# EAGLE design funcgen (EAGLE 9.6.2)

## Sheet 1 of 3
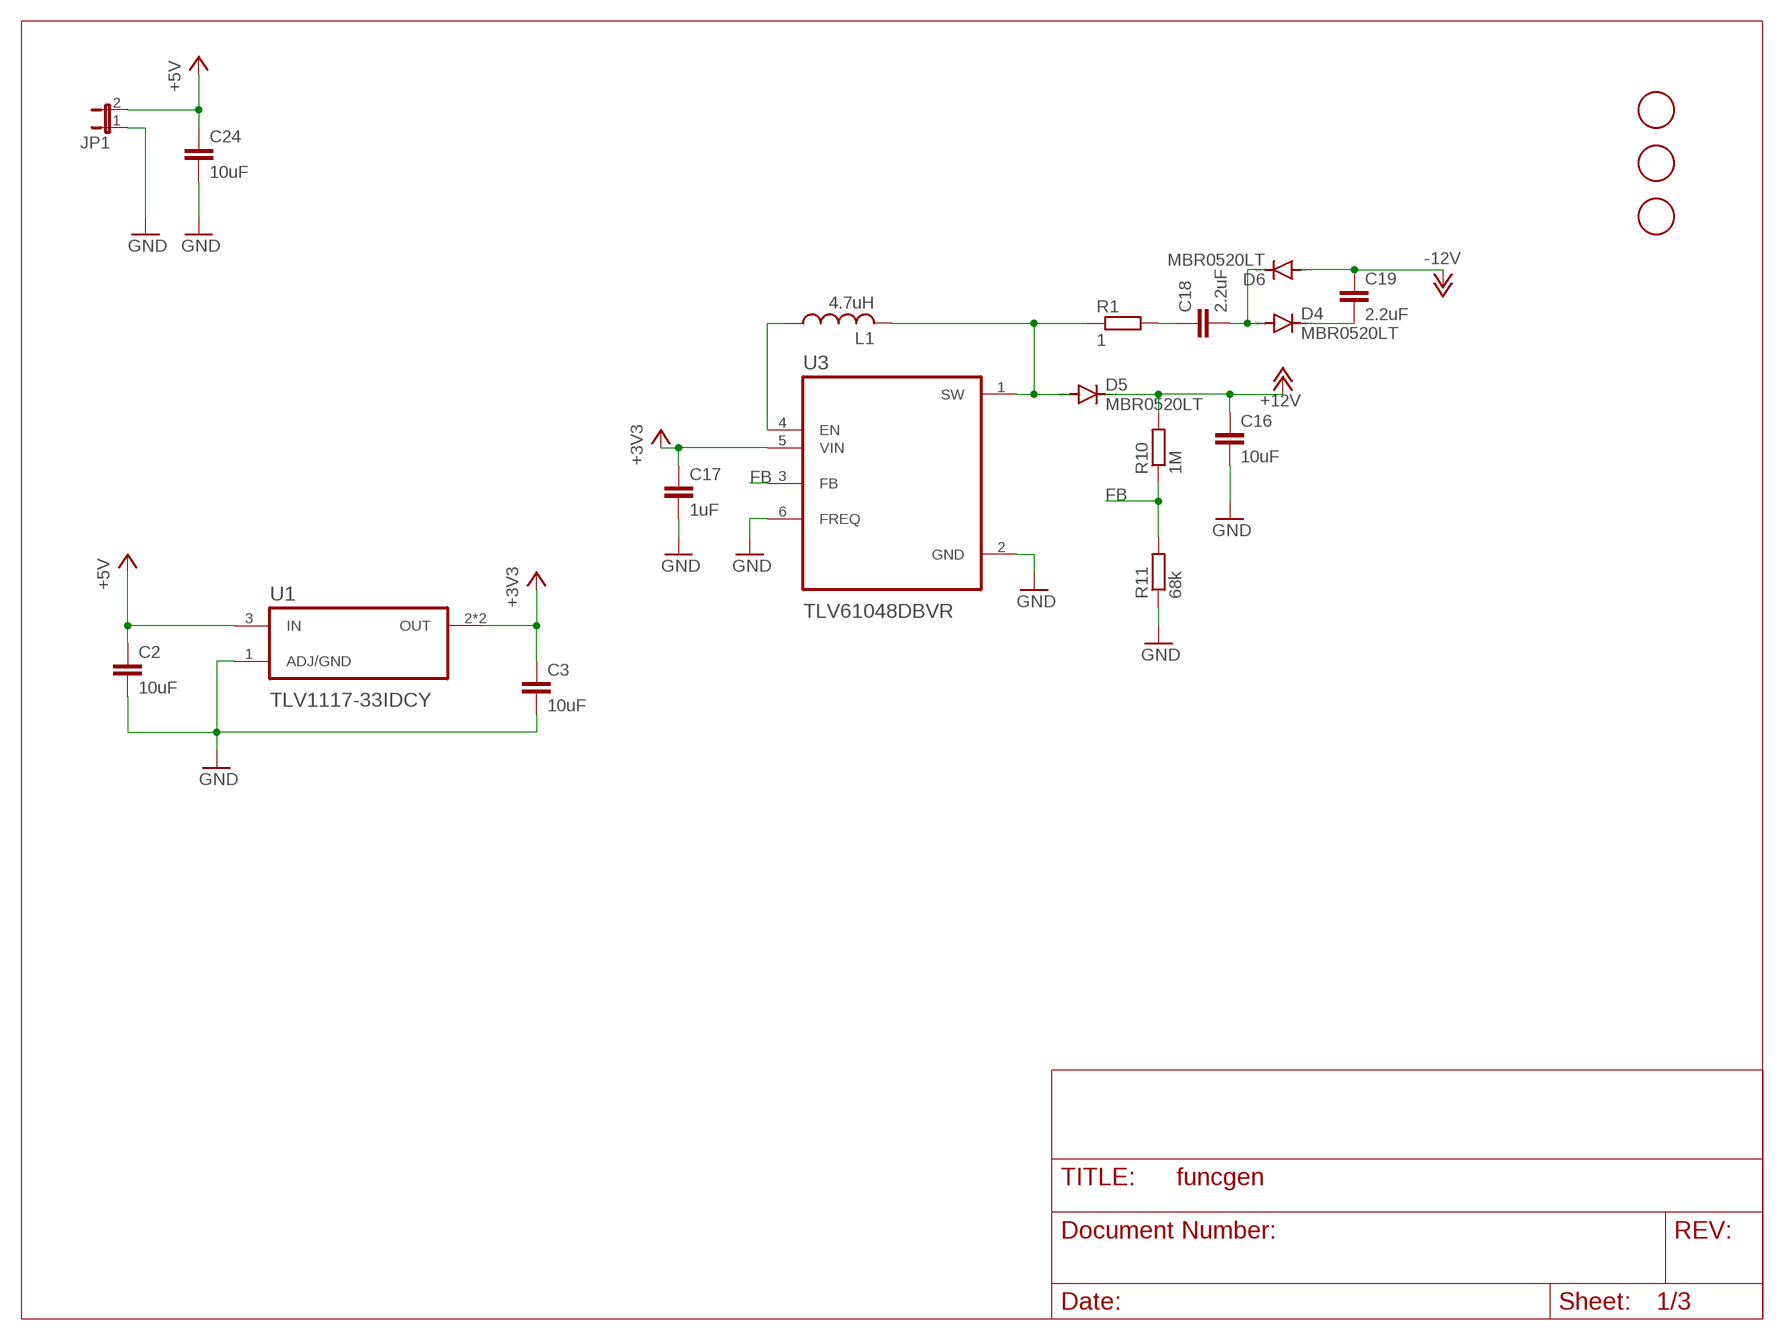
[diagram p0: schematic, sheet 1]

### Parts
C2  10uF  C-EUC0805  [C0805]
C3  10uF  C-EUC0805  [C0805]
C16  10uF  C-EUC0805  [C0805]
C17  1uF  C-EUC0805  [C0805]
C18  2.2uF  C-EUC0805  [C0805]
C19  2.2uF  C-EUC0805  [C0805]
C24  10uF  C-EUC0805  [C0805]
D4  MBR0520LT  [SOD123]
D5  MBR0520LT  [SOD123]
D6  MBR0520LT  [SOD123]
JP1  JP1E  [JP1]
L1  4.7uH  L-USL0805  [C0805]
R1  1  R-EU_R0805  [R0805]
R10  1M  R-EU_R0805  [R0805]
R11  68k  R-EU_R0805  [R0805]
U1  TLV1117-33IDCY  [SOT230P700X180-4N]
U3  TLV61048DBVR  [SOT95P280X145-6N]
U$1  FIDUCIAL  [FIDUCIAL_1MM]
U$3  FIDUCIAL  [FIDUCIAL_1MM]
U$4  FIDUCIAL  [FIDUCIAL_1MM]

### Nets
+3V3: C3.1 C17.1 U1.2(OUT) U1.4(OUT) U3.5(VIN) ; also sheet 2
+5V: C2.1 C24.1 JP1.2 U1.3(IN) ; also sheet 2,3
+12V: C16.1 D5.C R10.2 ; also sheet 2
-12V: C19.1 D6.A ; also sheet 2
FB: R10.1 R11.2 U3.3(FB)
GND: C2.2 C3.2 C16.2 C17.2 C24.2 JP1.1 R11.1 U1.1(ADJ/GND) U3.2(GND) U3.6(FREQ) ; also sheet 2,3
N$8: L1.1 U3.4(EN)
N$9: D5.A L1.2 R1.1 U3.1(SW)
N$10: C18.1 R1.2
N$11: C18.2 D4.A D6.C
N$12: C19.2 D4.C

## Sheet 2 of 3
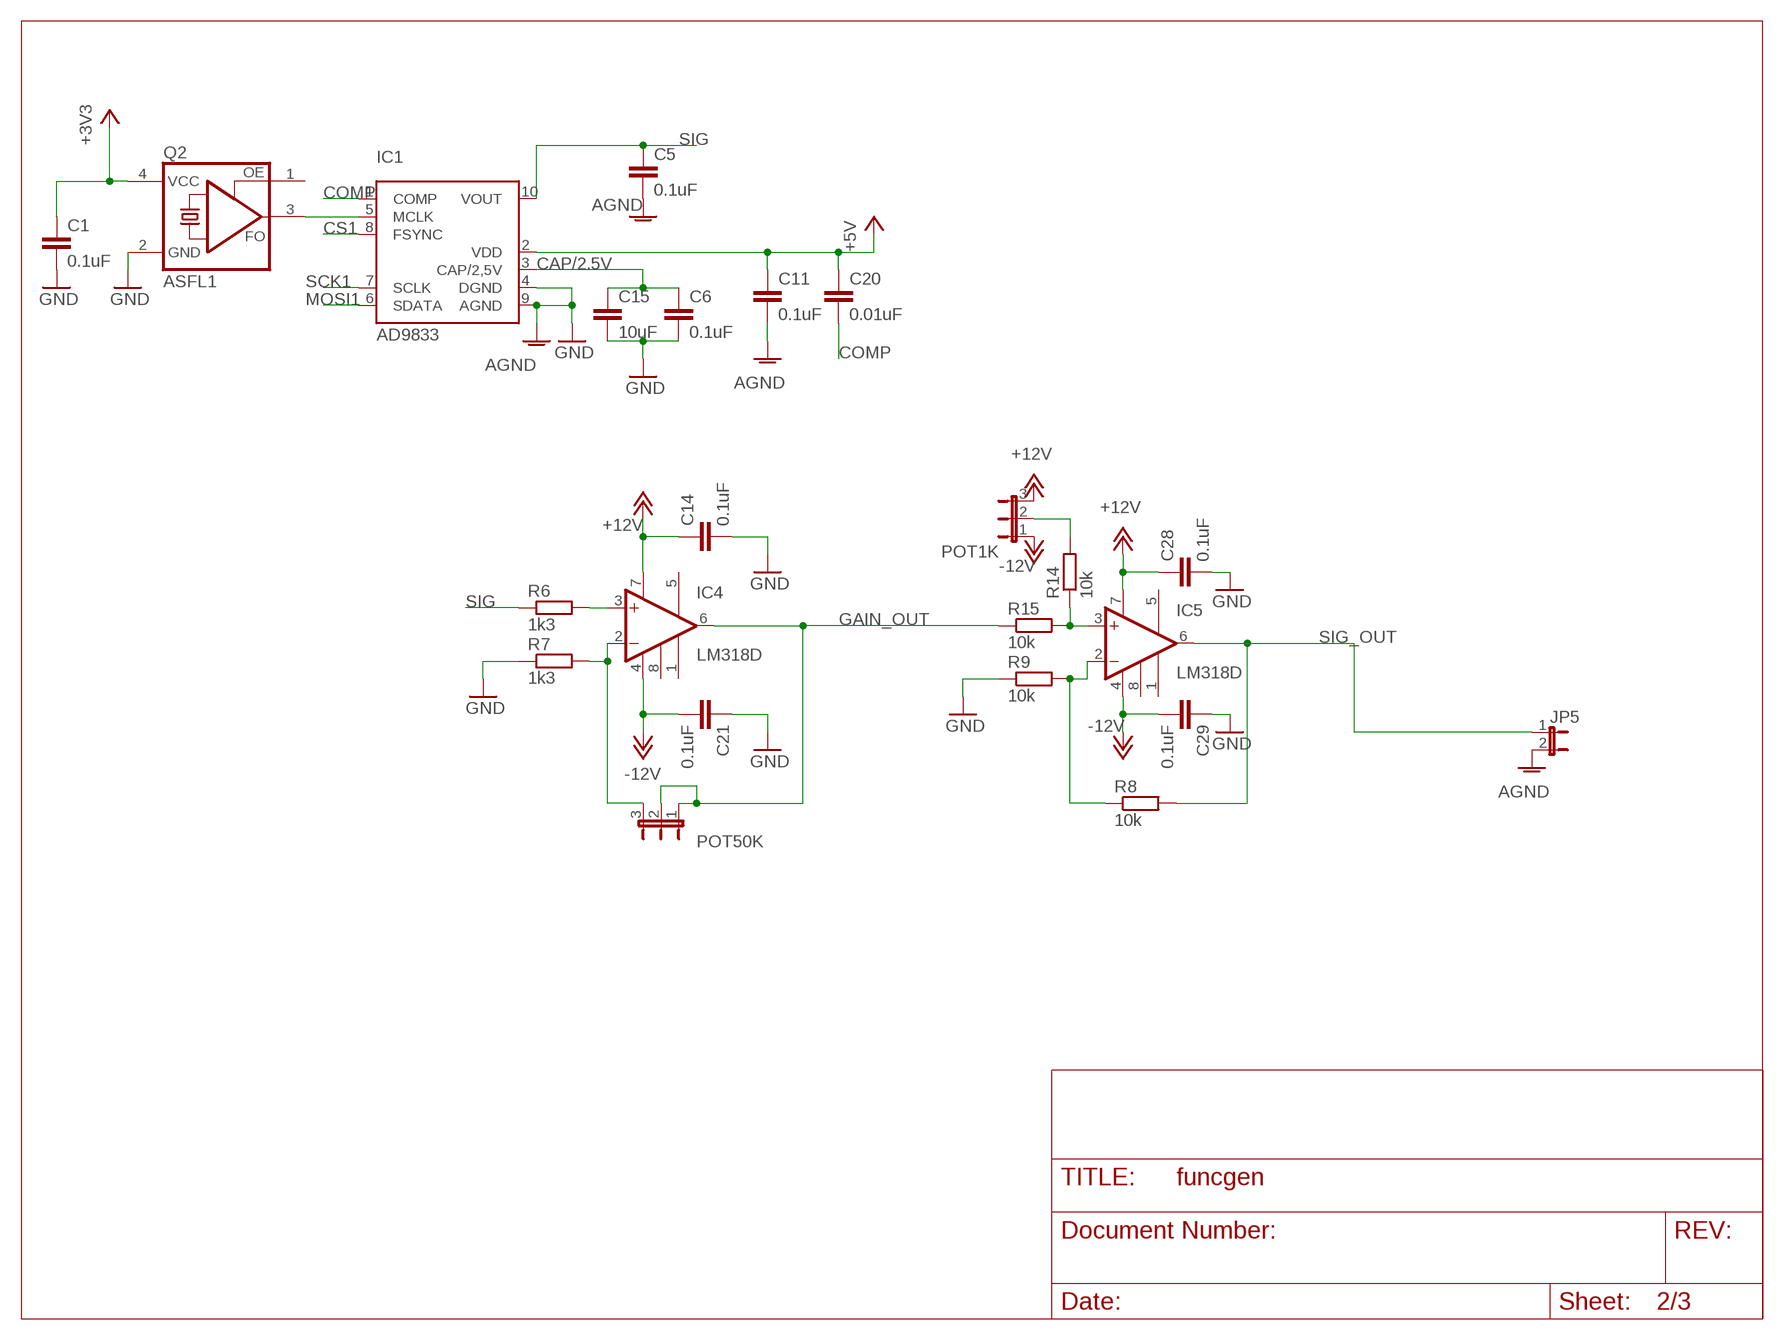
[diagram p1: schematic, sheet 2]

### Parts
C1  0.1uF  C-EUC0805  [C0805]
C5  0.1uF  C-EUC0805  [C0805]
C6  0.1uF  C-EUC0805  [C0805]
C11  0.1uF  C-EUC0805  [C0805]
C14  0.1uF  C-EUC0805  [C0805]
C15  10uF  C-EUC0805  [C0805]
C20  0.01uF  C-EUC0805  [C0805]
C21  0.1uF  C-EUC0805  [C0805]
C28  0.1uF  C-EUC0805  [C0805]
C29  0.1uF  C-EUC0805  [C0805]
IC1  AD9833  [MSOP10]
IC4  LM318D  [SOIC8]
IC5  LM318D  [SOIC8]
JP5  JP1E  [JP1]
POT1K  JP2E  [JP2]
POT50K  JP2E  [JP2]
Q2  ASFL1  [ASF]
R6  1k3  R-EU_R0805  [R0805]
R7  1k3  R-EU_R0805  [R0805]
R8  10k  R-EU_R0805  [R0805]
R9  10k  R-EU_R0805  [R0805]
R14  10k  R-EU_R0805  [R0805]
R15  10k  R-EU_R0805  [R0805]

### Nets
+3V3: C1.1 Q2.4(VCC) ; also sheet 1
+5V: C11.1 C20.1 IC1.2(VDD) ; also sheet 1,3
+12V: C14.1 C28.1 IC4.7(V+) IC5.7(V+) POT1K.3 ; also sheet 1
-12V: C21.2 C29.2 IC4.4(V-) IC5.4(V-) POT1K.1 ; also sheet 1
AGND: C5.2 C11.2 IC1.4(DGND) IC1.9(AGND) JP5.2 ; supply symbol labelled GND
CAP/2.5V: C6.1 C15.1 IC1.3(CAP/2,5V)
COMP: C20.2 IC1.1(COMP)
CS1: IC1.8(FSYNC) ; also sheet 3
GAIN_OUT: IC4.6(OUT) POT50K.1 POT50K.2 R15.1
GND: C1.2 C6.2 C14.2 C15.2 C21.1 C28.2 C29.1 Q2.2(GND) R7.1 R9.1 ; also sheet 1,3
MOSI1: IC1.6(SDATA) ; also sheet 3
N$6: IC1.5(MCLK) Q2.3(FO)
N$21: IC4.3(+IN) R6.2
N$22: IC4.2(-IN) POT50K.3 R7.2
N$24: IC5.3(+IN) R14.1 R15.2
N$25: POT1K.2 R14.2
N$26: IC5.2(-IN) R8.1 R9.2
SCK1: IC1.7(SCLK) ; also sheet 3
SIG: C5.1 IC1.10(VOUT) R6.1
SIG_OUT: IC5.6(OUT) JP5.1 R8.2
Unconnected: IC4.1(BAL1) IC4.5(BAL2) IC4.8(COMP) IC5.1(BAL1) IC5.5(BAL2) IC5.8(COMP) Q2.1(OE)

## Sheet 3 of 3
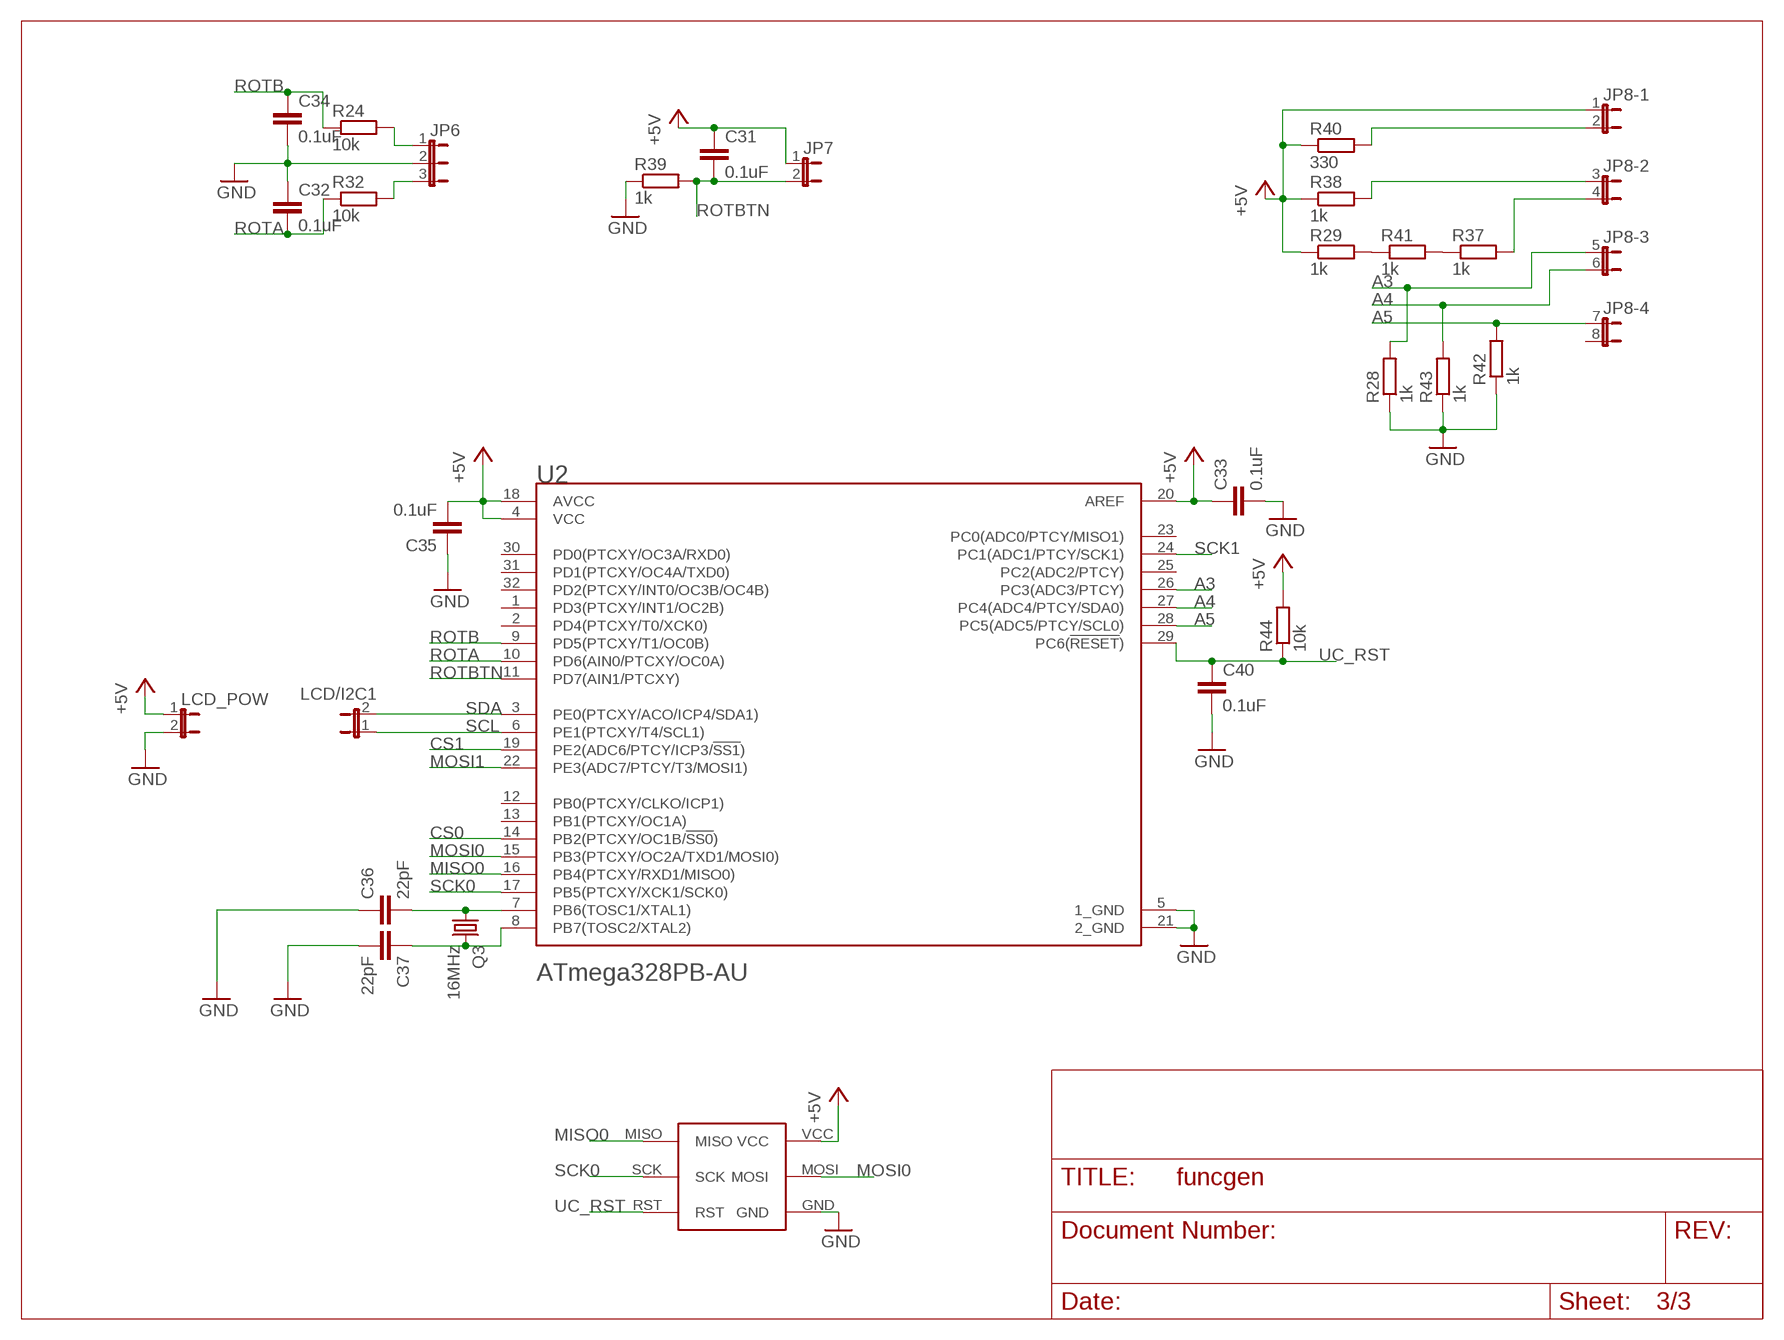
[diagram p2: schematic, sheet 3]

### Parts
C31  0.1uF  C-EUC0805  [C0805]
C32  0.1uF  C-EUC0805  [C0805]
C33  0.1uF  C-EUC0805  [C0805]
C34  0.1uF  C-EUC0805  [C0805]
C35  0.1uF  C-EUC0805  [C0805]
C36  22pF  C-EUC0805  [C0805]
C37  22pF  C-EUC0805  [C0805]
C40  0.1uF  C-EUC0805  [C0805]
JP6  JP2E  [JP2]
JP7  JP1E  [JP1]
JP8  JP4QE  [JP4Q]
LCD/I2C1  JP1E  [JP1]
LCD_POW  JP1E  [JP1]
Q3  16MHz  CRYSTALHC49UP  [HC49UP]
R24  10k  R-EU_R0805  [R0805]
R28  1k  R-EU_R0805  [R0805]
R29  1k  R-EU_R0805  [R0805]
R32  10k  R-EU_R0805  [R0805]
R37  1k  R-EU_R0805  [R0805]
R38  1k  R-EU_R0805  [R0805]
R39  1k  R-EU_R0805  [R0805]
R40  330  R-EU_R0805  [R0805]
R41  1k  R-EU_R0805  [R0805]
R42  1k  R-EU_R0805  [R0805]
R43  1k  R-EU_R0805  [R0805]
R44  10k  R-EU_R0805  [R0805]
U2  MICROCHIP_ATMEGA328PB-AUMICROCHIP_ATMEGA328PB-AU_0_0  [MICROCHIP_ATMEGA328PB-AU_0]
U$2  AVR-ISP  [AVR-ISP]

### Nets
+5V: C31.1 C33.1 C35.2 JP7.1 JP8.1 LCD_POW.1 R29.1 R38.1 R40.1 R44.2 U2.4(VCC) U2.18(AVCC) U2.20(AREF) U$2.VCC ; also sheet 1,2
A3: JP8.5 R28.2 U2.26(PC3(ADC3/PTCY))
A4: JP8.6 R43.2 U2.27(PC4(ADC4/PTCY/SDA0))
A5: JP8.7 R42.2 U2.28(PC5(ADC5/PTCY/SCL0))
CS0: U2.14(PB2(PTCXY/OC1B/!SS0!))
CS1: U2.19(PE2(ADC6/PTCY/ICP3/!SS1!)) ; also sheet 2
GND: C32.1 C33.2 C34.2 C35.1 C36.1 C37.2 C40.2 JP6.2 LCD_POW.2 R28.1 R39.1 R42.1 R43.1 U2.5(1_GND) U2.21(2_GND) U$2.GND ; also sheet 1,2
MISO0: U2.16(PB4(PTCXY/RXD1/MISO0)) U$2.MISO
MOSI0: U2.15(PB3(PTCXY/OC2A/TXD1/MOSI0)) U$2.MOSI
MOSI1: U2.22(PE3(ADC7/PTCY/T3/MOSI1)) ; also sheet 2
N$30: JP6.1 R24.2
N$31: JP6.3 R32.2
N$32: C36.2 Q3.1 U2.7(PB6(TOSC1/XTAL1))
N$33: C37.1 Q3.2 U2.8(PB7(TOSC2/XTAL2))
N$34: R37.1 R41.2
N$35: R29.2 R41.1
N$36: JP8.2 R40.2
N$37: JP8.3 R38.2
N$38: JP8.4 R37.2
ROTA: C32.2 R32.1 U2.10(PD6(AIN0/PTCXY/OC0A))
ROTB: C34.1 R24.1 U2.9(PD5(PTCXY/T1/OC0B))
ROTBTN: C31.2 JP7.2 R39.2 U2.11(PD7(AIN1/PTCXY))
SCK0: U2.17(PB5(PTCXY/XCK1/SCK0)) U$2.SCK
SCK1: U2.24(PC1(ADC1/PTCY/SCK1)) ; also sheet 2
SCL: LCD/I2C1.1 U2.6(PE1(PTCXY/T4/SCL1))
SDA: LCD/I2C1.2 U2.3(PE0(PTCXY/ACO/ICP4/SDA1))
UC_RST: C40.1 R44.1 U2.29(PC6(!RESET!)) U$2.RST
Unconnected: JP8.8 U2.1(PD3(PTCXY/INT1/OC2B)) U2.2(PD4(PTCXY/T0/XCK0)) U2.12(PB0(PTCXY/CLKO/ICP1)) U2.13(PB1(PTCXY/OC1A)) U2.23(PC0(ADC0/PTCY/MISO1)) U2.25(PC2(ADC2/PTCY)) U2.30(PD0(PTCXY/OC3A/RXD0)) U2.31(PD1(PTCXY/OC4A/TXD0)) U2.32(PD2(PTCXY/INT0/OC3B/OC4B))

## Library data of the parts
C1-C3 C5 C6 C11 C14-C21 C24 C28 C29 C31-C37 C40 = rcl:C-EU: CAPACITOR, European symbol; SPICEPREFIX: C
D4-D6 = diode:MBR0520LT: SCHOTTKY BARRIER RECTIFIER Source: http://onsemi.com .. MBR0520LT1-D.pdf
IC1 = AD9833:AD9833: LowPower Waveform Generator Clock Rate up to 12,5 MHz Serial Interface Low Pin Count Check prices <https://pricing.snapeda.com/search/part/AD9833/?ref=eda>; AVAILABILITY: Bad; DESCRIPTION: Direct Digital Synthesis IC 10 b 25MHz 28 b Tuning 10-MSOP; MF: Analog Devices; MP: AD9833; PACKAGE: MSOP-10 Analog Devices; PRICE: None
IC4 IC5 = linear:LM*18: FAST GENERAL-PURPOSE OPERATIONAL AMPLIFIER Sourde: http://focus.ti.com/lit/ds/slos063b/slos063b.pdf
JP1 JP5 JP7 LCD/I2C1 LCD_POW = jumper:JP1E: JUMPER
JP6 POT1K POT50K = jumper:JP2E: JUMPER
JP8 = jumper:JP4QE: JUMPER
L1 = rcl_2:L-US: INDUCTOR, American symbol
Q2 = crystal:ASF*: CRYSTAL CLOCK OSCILLATORS 5.0 Vdc or 3.3 Vdc - LOW PROFILE ULTRA MINIATURE CERAMIC SURFACE MOUNT Source: http://www.abracon.com/Oscillators/asf1-L-L1.pdf; MF: Abracon Corporation; MPN: ASFL1-125.000MHZ-EC-T; OC_FARNELL: 1838931; OC_NEWARK: 19M1882
Q3 = crystal:CRYSTAL: CRYSTAL; OC_FARNELL: unknown; OC_NEWARK: unknown
R1 R6-R11 R14 R15 R24 R28 R29 R32 R37-R44 = rcl:R-EU_: RESISTOR, European symbol; SPICEPREFIX: R
U1 = TLV1117-33IDCY:TLV1117-33IDCY: Check prices <https://pricing.snapeda.com/parts/TLV1117-33IDCY/Texas%20Instruments/view-part?ref=eda>; AVAILABILITY: Good; DESCRIPTION: 800-mA, 15-V, linear voltage regulator 4-SOT-223 -40 to 125; MF: Texas Instruments; MP: TLV1117-33IDCY; PACKAGE: SOT-223-4 Texas Instruments; PRICE: None; PURCHASE-URL: https://pricing.snapeda.com/search/part/TLV1117-33IDCY/?ref=eda
U2 = Microchip - ATmega328PB-AU:MICROCHIP_ATMEGA328PB-AU: ATmega328PB Summary Datasheet; CENTROID_NOT_SPECIFIED: No; DATASHEET: http://ww1.microchip.com/downloads/en/DeviceDoc/40001907A.pdf; DIGIKEY_DESCRIPTION: IC MCU 8BIT 32KB FLASH 32TQFP; DIGIKEY_PART_NUMBER: ATMEGA328PB-AU-ND; LEAD_FREE: yes; MF: Microchip; MFG_PACKAGE_IDENT: 32A; MOUSER_PART_NUMBER: 556-ATMEGA328PB-AU; MPN: ATmega328PB-AU; PACKAGE: TQFP32; PREFIX: U; ROHS: yes; TEMPERATURE_RANGE_HIGH: +85°C; TEMPERATURE_RANGE_LOW: -40°C; VOLTAGE: 5.5V
U3 = TLV61048DBVR:TLV61048DBVR: Check prices <https://pricing.snapeda.com/search/part/TLV61048DBVR/?ref=eda>; AVAILABILITY: Warning; DESCRIPTION: 14-V output voltage non-synchronous boost converter in SOT-23 package 6-SOT-23 -40 to 125; MF: Texas Instruments; MP: TLV61048DBVR; PACKAGE: SOT-23-6 Texas Instruments; PRICE: None; PURCHASE-URL: https://pricing.snapeda.com/search/part/TLV61048DBVR/?ref=eda
U$1 U$3 U$4 = ECE388:FIDUCIAL: For use by pick and place machines to calibrate the vision/machine, 1mm By microbuilder.eu
U$2 = AVR-ISP:AVR-ISP: Check prices <https://pricing.snapeda.com/parts/AVR-ISP/Gravitech/view-part?ref=eda>; AVAILABILITY: Bad; DESCRIPTION: Emulators / Simulators AVR USB IN CIRCUIT EMUL/PRGMR ISP; MF: Gravitech; MP: AVR-ISP; PACKAGE: None; PRICE: None

## Board
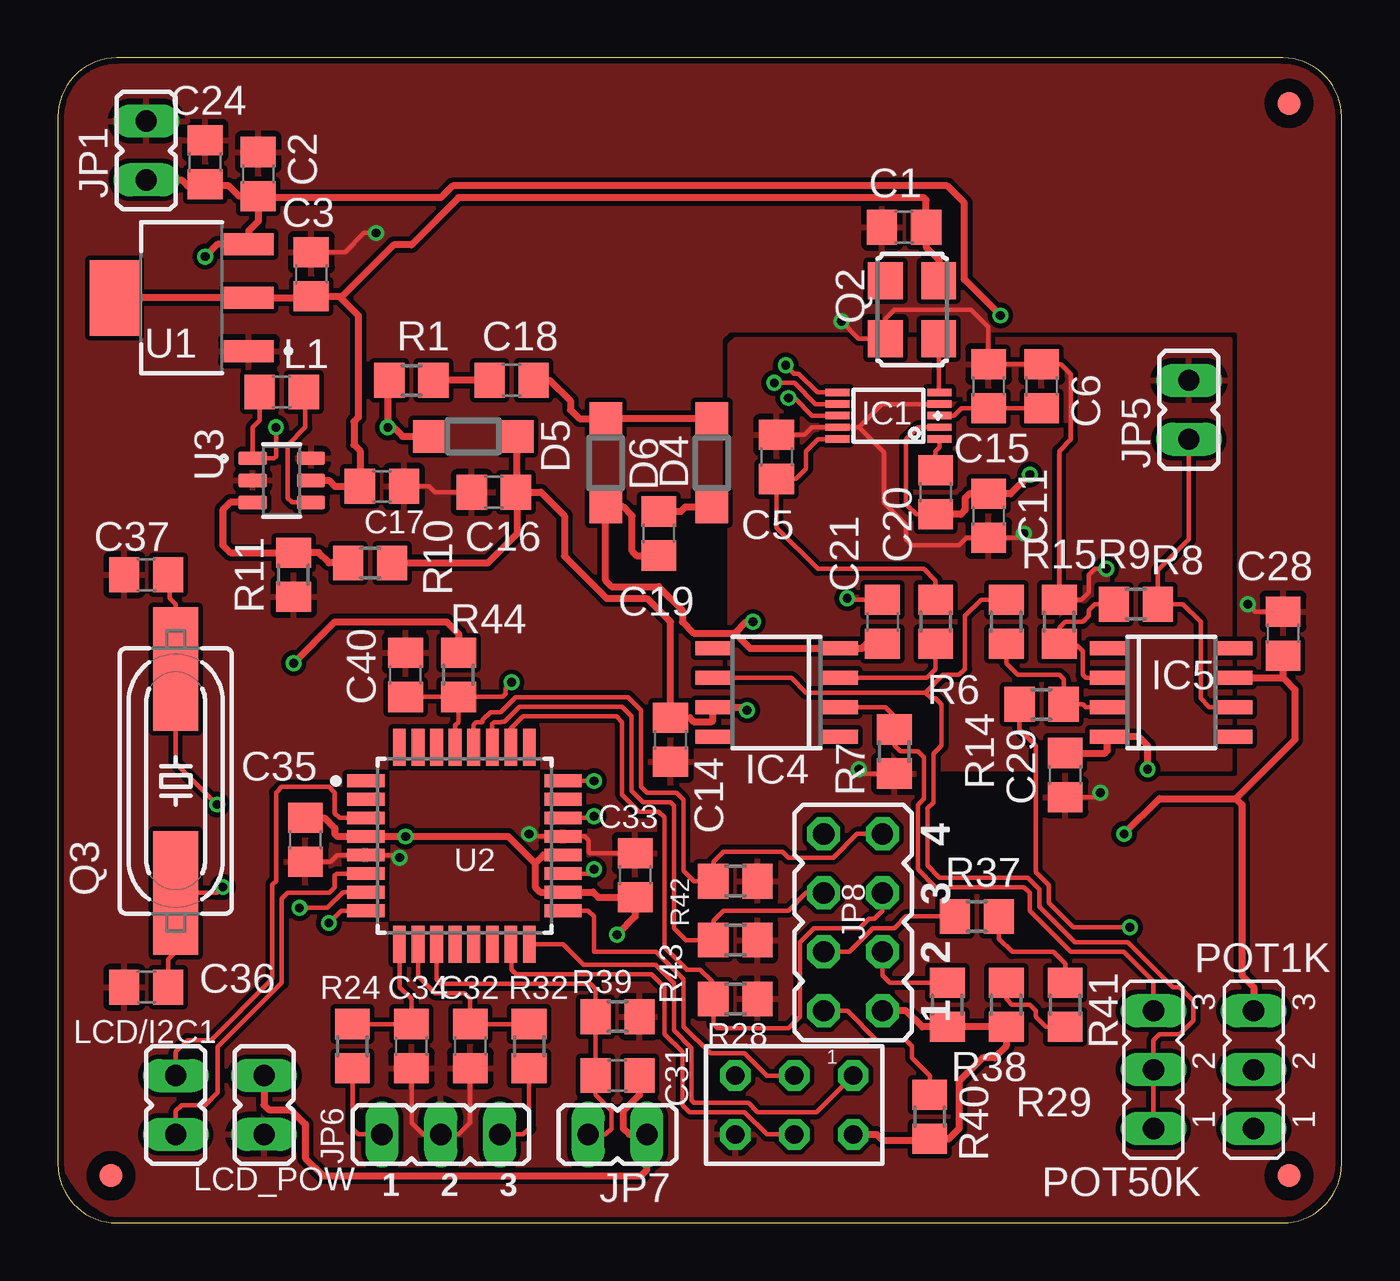
[diagram p3: board, top side]
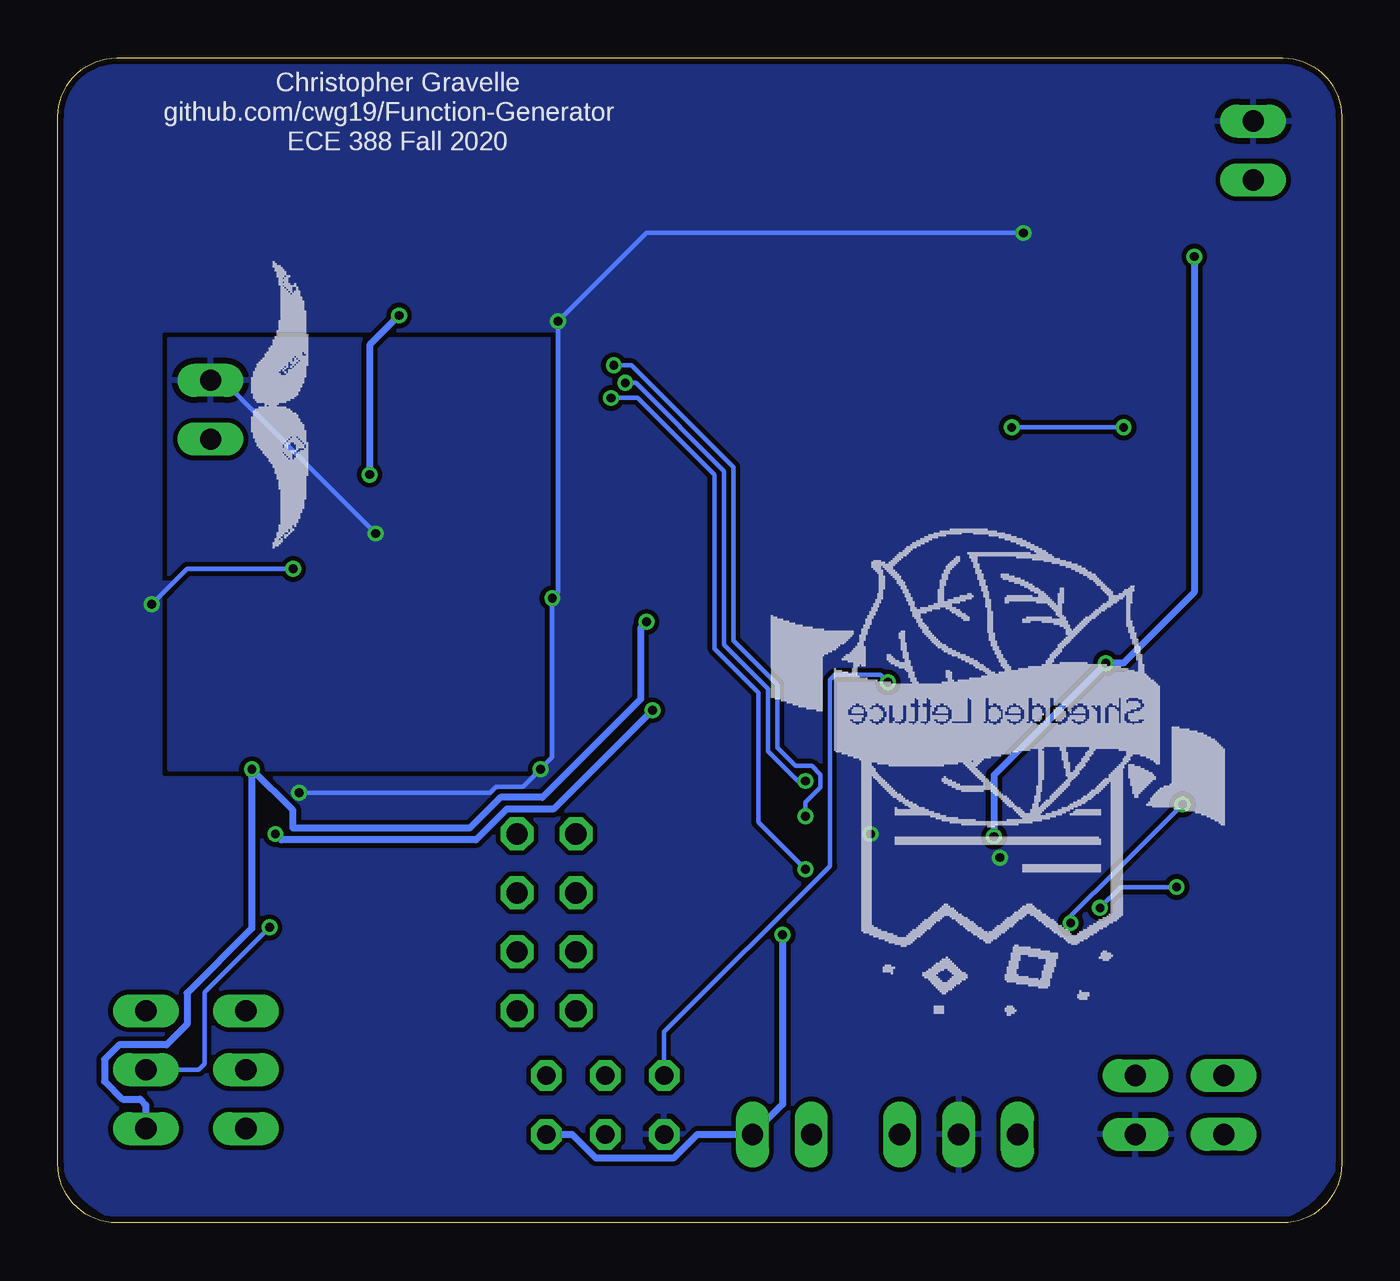
[diagram p4: board, bottom side, seen from below]

Size 55.35 x 50.22 mm. Coordinates in mm from the lower left corner, seen from the top.
Outline: 55.35,2.54 55.35,47.68 arc90 52.81,50.22 2.54,50.22 arc90 0,47.68 0,2.54 arc90 2.54,0 52.81,0 arc90 55.35,2.54
Copper layers (1*16): Top 0.035mm / dielectric 1.5mm / Bottom 0.035mm
Design rules "Dirty8TS": minimum track width 8mil, minimum drill 15mil, track to track 8mil, track to pad 8mil, pad to pad 8mil, via to via 8mil, smd to smd 0mil, copper to edge 10mil, drill to drill 10mil, minimum pad ring 10mil, minimum via ring 6mil, stop-mask expansion 2mil, vias tented up to drill 25mil, thermal gap 10mil

### Footprints (pad centres in the part's own frame; a part is rotated, then mirrored left to right if it is on the bottom)
C0805 = smd 1.3 x 1.5: 1 -0.95,0; 2 0.95,0
SOD123 = smd 1.4 x 1.4: A 1.9,0; C -1.9,0
MSOP10 = smd 0.32 x 1.05: 1 -1,-2.2; 2 -0.5,-2.2; 3 0,-2.2; 4 0.5,-2.2; 5 1,-2.2; 6 1,2.2; 7 0.5,2.2; 8 0,2.2; 9 -0.5,2.2; 10 -1,2.2
SOIC8 = smd 0.6 x 1.5: 1 -1.905,-2.75; 2 -0.635,-2.75; 3 0.635,-2.75; 4 1.905,-2.75; 5 1.905,2.75; 6 0.635,2.75; 7 -0.635,2.75; 8 -1.905,2.75
JP1 = drill 0.914 long: 1 0,-1.27; 2 0,1.27
JP2 = drill 0.914 long: 1 -2.54,0; 2 0,0; 3 2.54,0
JP4Q = drill 0.914 octagon: 1 -3.81,-1.27; 2 -3.81,1.27; 3 -1.27,-1.27; 4 -1.27,1.27; 5 1.27,-1.27; 6 1.27,1.27; 7 3.81,-1.27; 8 3.81,1.27
ASF = smd 1.6 x 1.5: 1 -1.25,-1.15; 2 1.25,-1.15; 3 1.25,1.15; 4 -1.25,1.15
HC49UP = smd 5.334 x 1.93: 1 -4.826,0; 2 4.826,0
R0805 = smd 1.3 x 1.5: 1 -0.95,0; 2 0.95,0
SOT230P700X180-4N = smd 2.15 x 0.95: 1 -2.9,2.3; 2 -2.9,0; 3 -2.9,-2.3 | smd 2.15 x 3.25: 4 2.9,0
MICROCHIP_ATMEGA328PB-AU_0 = smd 1.6 x 0.55: 1 -4.25,2.8; 2 -4.25,2; 3 -4.25,1.2; 4 -4.25,0.4; 5 -4.25,-0.4; 6 -4.25,-1.2; 7 -4.25,-2; 8 -4.25,-2.8; 17 4.25,-2.8; 18 4.25,-2; 19 4.25,-1.2; 20 4.25,-0.4; 21 4.25,0.4; 22 4.25,1.2; 23 4.25,2; 24 4.25,2.8 | smd 0.55 x 1.6: 9 -2.8,-4.25; 10 -2,-4.25; 11 -1.2,-4.25; 12 -0.4,-4.25; 13 0.4,-4.25; 14 1.2,-4.25; 15 2,-4.25; 16 2.8,-4.25; 25 2.8,4.25; 26 2,4.25; 27 1.2,4.25; 28 0.4,4.25; 29 -0.4,4.25; 30 -1.2,4.25; 31 -2,4.25; 32 -2.8,4.25
SOT95P280X145-6N = smd 1.21 x 0.58: 1 -1.255,0.95; 2 -1.255,0; 3 -1.255,-0.95; 4 1.255,-0.95; 5 1.255,0; 6 1.255,0.95
FIDUCIAL_1MM = smd 1 x 1: 1 0,0
AVR-ISP = drill 0.8 octagon: GND 2.54,1.27; MISO -2.54,-1.27; MOSI 0,1.27; RST 2.54,-1.27; SCK 0,-1.27; VCC -2.54,1.27

### Placement (x,y rotation side)
C1  36.49,42.92 180 top
C2  8.64,45.21 90 top
C3  10.92,40.89 90 top
C5  30.99,33.02 90 top
C6  42.42,36.07 90 top
C11  40.13,30.48 270 top
C14  26.42,20.83 270 top
C15  40.13,36.07 90 top
C16  18.8,31.5 180 top
C17  13.97,31.75 0 top
C18  19.56,36.32 0 top
C19  25.91,29.72 90 top
C20  37.85,31.5 90 top
C21  35.56,25.91 270 top
C24  6.35,45.72 90 top
C28  52.83,25.4 90 top
C29  43.43,19.3 90 top
C31  24.13,6.35 180 top
C32  17.78,7.62 90 top
C33  24.89,14.99 90 top
C34  15.24,7.62 270 top
C35  10.67,16.51 90 top
C36  3.81,10.16 0 top
C37  3.81,27.94 180 top
C40  14.99,23.62 90 top
D4  28.19,32.77 90 top
D5  17.91,33.91 180 top
D6  23.62,32.77 270 top
IC1  35.81,34.8 90 top
IC4  30.99,22.86 90 top
IC5  48.01,22.86 270 top
JP1  3.81,46.23 180 top
JP5  48.77,35.05 0 top
JP6  16.51,3.81 0 top
JP7  24.13,3.81 90 top
JP8  34.29,12.95 90 top
L1  9.65,35.81 180 top
LCD/I2C1  5.08,5.08 0 top
LCD_POW  8.89,5.08 180 top
POT1K  51.56,6.6 90 top
POT50K  47.24,6.6 90 top
Q2  36.83,39.37 270 top
Q3  5.08,19.05 90 top
R1  15.24,36.32 0 top
R6  37.85,25.91 270 top
R7  36.07,20.32 90 top
R8  46.48,26.67 0 top
R9  43.18,25.91 270 top
R10  13.46,28.45 0 top
R11  10.16,27.94 90 top
R14  42.42,22.35 180 top
R15  40.89,25.91 270 top
R24  12.7,7.62 270 top
R28  29.21,9.65 180 top
R29  40.89,9.4 90 top
R32  20.32,7.62 270 top
R37  39.62,13.21 180 top
R38  38.35,9.4 90 top
R39  24.13,8.89 180 top
R40  37.59,4.57 90 top
R41  43.43,9.4 90 top
R42  29.21,14.73 180 top
R43  29.21,12.19 180 top
R44  17.27,23.62 90 top
U1  5.33,39.88 180 top
U2  17.53,16.26 0 top
U3  9.65,32 0 top
U$1  53.09,48.26 0 top
U$2  31.75,5.08 180 top
U$3  2.29,2.03 0 top
U$4  53.09,2.03 0 top

### Tracks (layer width: path | path; a pad name or v marks a point on that pad's centre or on a via)
+3V3
  Top 0.305: U1.4 U1.2 10.86,39.88 C3.1 12.13,39.94 12.19,39.88 | U3.5 11.68,32 11.94,31.75 C17.1 13.02,33.28 12.76,33.54 12.76,34.53 12.95,34.73 12.95,39.12 12.19,39.88 | 12.19,39.88 14.48,42.16 15.24,42.16 17.27,44.2 37.34,44.2 37.44,44.1 C1.1 37.44,42.06 37.98,41.52 Q2.4
+5V  (via drill 0.38)
  Top 0.203: IC1.2 37.08,34.29 36.58,33.78 36.58,30.99 37.02,30.55 C20.1
  Top 0.305: C2.1 8.64,43.18 8.23,42.78 U1.3 6.87,42.18 v6.35,41.66 | C35.2 11.5,17.46 11.94,17.02 11.94,16.76 12.05,16.66 U2.4 v14.99,16.66 19.41,16.66 20.57,15.49 | C31.1 25.08,5.52 24.38,4.83 24.38,4.06 24.64,3.81 JP7.1 25.4,2.29 25.15,2.03 11.43,2.03 10.67,2.79 10.67,4.25 10.04,4.88 9.09,4.88 8.89,5.08 LCD_POW.1 | U$2.VCC 35.31,3.81 35.56,3.56 37.53,3.56 R40.1 38.42,3.62 38.86,4.06 38.86,6.1 39.88,7.11 40.39,7.11 40.89,7.62 R29.1 R38.1 37.27,8.45 36.58,9.14 JP8.1 | U2.20 20.94,15.86 20.57,15.49 | 20.57,15.49 20.57,14.48 20.8,14.26 U2.18 23.08,14.26 23.3,14.04 C33.1 24.89,13.21 v24.1,12.42 | C20.1 38.93,30.55 39.12,30.73 39.12,31.24 39.3,31.43 C11.1 41.08,31.43 v41.91,32.26 | v40.64,39.12 39.09,40.67 39.09,43.97 38.35,44.7 17.02,44.7 16.51,44.2 8.7,44.2 C2.1 | v10.16,24.13 11.94,25.91 16.76,25.91 17.27,25.4 R44.2 | JP1.2 5.33,44.96 5.59,44.7 6.28,44.7 | 6.28,44.7 C24.1 | C2.1 7.81,44.26 7.37,44.7 6.28,44.7
  Bottom 0.305: U$2.VCC 33.18,3.81 32.17,2.8 28.79,2.8 27.78,3.81 JP7.1 24.1,5.11 v24.1,12.42 | v40.64,39.12 41.91,37.85 v41.91,32.26 | v6.35,41.66 6.35,27.18 9.4,24.13 v10.16,24.13 14.99,19.3 v14.99,16.66
+12V  (via drill 0.38)
  Top 0.305: C16.1 20.83,31.5 21.84,30.48 21.84,28.75 23.67,26.92 25.4,26.92 26.42,25.91 C14.1 27.24,21.78 27.41,21.61 28.19,21.61 28.24,21.66 IC4.7 29.59,22.23 v29.72,22.1 | R10.2 18.54,28.45 19.81,29.72 19.81,31.43 C16.1 | IC5.7 52.83,23.5 | 52.83,23.5 53.34,22.99 53.34,20.83 50.8,18.29 | 52.83,23.5 C28.1 | v45.97,16.76 47.5,18.29 50.8,18.29 | 50.8,18.29 51.05,18.03 51.05,10.67 51.56,10.16 POT1K.3 | C16.1 19.81,31.56 D5.C
  Bottom 0.305: v29.72,22.1 33.98,17.83 36,17.83 37.32,16.51 45.72,16.51 v45.97,16.76
-12V  (via drill 0.38)
  Top 0.305: C21.2 34.86,24.96 34.67,24.77 IC4.4 29.84,24.77 29.19,25.42 | C29.2 45.15,20.25 45.26,20.36 IC5.4 46.61,20.95 46.99,20.57 v46.99,19.56 | 29.19,25.42 27.41,25.42 26.92,25.91 26.92,26.42 25.91,27.43 23.88,27.43 23.62,27.69 D6.A 24.38,30.87 24.77,30.48 24.77,28.96 24.95,28.77 C19.1 | 29.19,25.42 29.68,25.91 v29.97,25.91
  Bottom 0.305: v29.97,25.91 30.23,25.65 30.23,22.58 34.47,18.34 36.27,18.34 37.59,17.02 45.21,17.02 45.21,17.78 v46.99,19.56 46.99,12.7 49.78,9.91 49.78,8.56 50.67,7.67 52.72,7.67 53.34,7.05 53.34,6.1 52.58,5.33 51.82,5.33 51.56,5.08 POT1K.1
A3
  Top 0.203: JP8.5 35.56,13.46 35.2,13.11 34.97,13.11 34.56,12.7 32.6,12.7 32,12.11 32,8.89 31.5,8.38 28.45,8.38 28.26,8.57 R28.2 28.19,9.72 28.19,10.41 27.69,10.92 27.12,10.92 26.16,11.88 26.16,17.48 25.91,17.73 25.06,17.73 24.33,18.46 24.33,21.59 24.08,21.84 20.07,21.84 19.53,21.3 U2.26
A4
  Top 0.203: JP8.6 32.26,14.22 31.5,13.46 28.7,13.46 28.26,13.02 R43.2 27.08,12.19 26.57,12.7 26.57,17.98 26.42,18.14 25.23,18.14 24.74,18.63 24.74,21.84 24.33,22.25 19.9,22.25 19.26,21.61 19.12,21.61 19.1,21.59 18.8,21.59 18.73,21.52 U2.27
A5
  Top 0.203: JP8.7 34.46,16.76 33.44,15.75 31.5,15.75 31.24,16 28.7,16 28.26,15.56 R42.2 27.43,14.73 26.98,15.19 26.98,18.24 26.67,18.54 25.4,18.54 25.15,18.8 25.15,22.1 24.59,22.66 19.73,22.66 19.09,22.02 18.65,22.02 18.32,21.69 18.32,21.62 18.29,21.59 18.03,21.59 17.93,21.48 U2.28
AGND  (via drill 0.38)
  Top 0.203: C5.2 32.19,33.97 32.51,34.29 IC1.9 34.54,34.3 | 34.54,34.3 35.61,33.22 35.61,31.05 36.58,30.09 36.58,29.46 36.83,29.21 38.86,29.21 39.18,29.53 C11.2 41.47,29.53 v41.66,29.72 | 34.54,34.3 35.54,35.3 IC1.4
  Bottom 0.203: v41.66,29.72 48.26,36.32 JP5.2
  pour Bottom: 29.21,38.1 50.55,38.1 50.55,19.56 28.96,19.56 28.96,37.85
  pour Top: 29.21,38.1 50.55,38.1 50.55,19.56 28.96,19.56 28.96,37.85
CAP/2.5V
  Top 0.203: C6.1 C15.1 38.95,35.12 38.63,34.8 IC1.3
COMP
  Top 0.203: IC1.1 38.01,33.44 37.85,33.27 C20.2
CS1  (via drill 0.38)
  Top 0.203: U2.19 22.93,15.06 v23.11,15.24 | v31.5,35.56 31.75,35.56 32.51,34.8 IC1.8
  Bottom 0.203: v23.11,15.24 25.15,17.27 25.15,22.86 27.04,24.75 27.04,32.24 30.36,35.56 v31.5,35.56
FB
  Top 0.305: R10.1 11.68,28.45 11.24,28.89 R11.2 7.43,28.89 7.11,29.21 7.11,30.73 7.43,31.05 U3.3
GAIN_OUT
  Top 0.203: IC4.6 31.62,23.5 32.26,22.86 37.41,22.86 | R15.1 39.81,26.86 39.12,26.16 39.12,23.88 38.86,23.62 38.17,23.62 37.41,22.86 | POT50K.1 POT50K.2 47.24,7.87 47.5,8.13 48.38,8.13 48.97,8.72 48.97,9.56 48.38,10.16 48.07,10.16 46.14,12.09 43.86,12.09 42.32,13.63 42.32,14.39 41.82,14.88 38.01,14.88 37.49,15.41 37.49,17.87 37.74,18.12 37.74,20.22 38.1,20.57 38.1,22.35 37.85,22.61 37.66,22.61 37.41,22.86
GND  (via drill 0.38)
  Top 0.203: C34.2 15.24,4.32 15.75,3.81 JP6.2 17.27,3.81 17.78,4.32 C32.1 | C28.2 51.63,26.35 v51.31,26.67 | v45.21,28.19 44.7,28.19 44.45,27.94 44.45,27.18 44.13,26.86 R9.1 43.18,33.27 43.69,33.78 43.69,36.58 43.25,37.02 C6.2 C15.2 40.13,38.61 39.37,39.37 36.07,39.37 35.68,38.98 Q2.2 34.52,38.12 v33.78,38.86 | C35.1 11.75,15.56 12.05,15.86 U2.5 14.62,15.86 v14.73,15.75 | C33.2 22.95,15.94 22.88,16 22.88,16.49 22.71,16.66 U2.21 20.43,16.66 v20.32,16.76 | C17.2 16,31.75 16.26,31.5 C16.2 | v13.72,42.67 13.21,42.67 12.38,41.84 C3.2 | C21.1 34.1,26.86 v34.04,26.92 | R7.1 34.73,19.37 v34.54,19.56 | C29.1 44.77,18.35 v44.96,18.54
  Bottom 0.203: v51.31,26.67 49.78,28.19 v45.21,28.19 | v13.72,42.67 29.97,42.67 v33.78,38.86 33.78,27.18 v34.04,26.92 34.04,20.07 v34.54,19.56 35.31,18.8 36.46,18.8 36.72,18.54 v44.96,18.54
  pour Bottom (rank 2): 51.56,0 3.89,0 arc-90 0,3.89 0,47.5 arc-90 2.54,50.04 52.83,50.04 arc-90 55.37,47.5 55.37,3.81 arc-90
  pour Top (rank 2): 51.56,0 3.89,0 arc-90 0,3.89 0,47.5 arc-90 2.54,50.04 52.83,50.04 arc-90 55.37,47.5 55.37,3.81 arc-90
MISO0
  Top 0.203: U2.16 21.78,12.01 22.66,11.12 25.77,11.12 26.57,10.33 26.57,8.3 27.33,7.53 27.33,5.28 27.43,5.17 29.77,5.17 30.18,4.78 32.72,4.78 U$2.MISO
MOSI0
  Top 0.203: U2.15 19.56,11.97 19.56,10.92 19.76,10.72 25.6,10.72 26.16,10.16 26.16,8.13 26.92,7.37 26.92,5.08 27.23,4.77 29.61,4.77 30.57,3.81 U$2.MOSI
MOSI1  (via drill 0.38)
  Top 0.203: v31.38,36.97 31.74,36.61 31.93,36.61 32.75,35.8 IC1.6 | U2.22 23.04,17.46 v23.11,17.53
  Bottom 0.203: v31.38,36.97 30.62,36.97 26.23,32.58 26.23,25.09 24.33,23.2 24.33,20.49 23.54,19.7 22.85,19.7 22.47,19.32 22.47,18.78 23.11,18.13 v23.11,17.53
N$6
  Top 0.203: IC1.5 37.98,35.83 Q2.3
N$8
  Top 0.203: U3.4 10.09,31.05 9.91,31.24 9.91,33.53 10.67,34.29 10.67,35.75 L1.1
N$9  (via drill 0.38)
  Top 0.203: v9.4,34.29 9.4,33.02 9.33,32.95 U3.1 8.4,34.3 8.7,34.61 L1.2
  Top 0.305: R1.1 14.22,36.26 v14.22,34.29 14.48,34.29 14.86,33.91 D5.A
  Bottom 0.203: v9.4,34.29 v14.22,34.29
N$10
  Top 0.305: C18.1 R1.2
N$11
  Top 0.305: C18.2 21.21,36.32 22.1,35.43 22.1,35.05 22.48,34.67 D6.C D4.A
N$12
  Top 0.305: C19.2 26.86,30.67 27.06,30.87 D4.C
N$21
  Top 0.203: IC4.3 37.47,23.5 37.85,23.88 R6.2
N$22
  Top 0.203: IC4.2 35.69,22.23 36.07,21.84 R7.2 36.07,20.58 36.32,20.32 37.08,20.32 37.34,20.07 37.34,18.29 37.08,18.03 37.08,15.24 37.85,14.48 41.66,14.48 41.91,14.22 41.91,13.46 43.69,11.68 45.97,11.68 47.24,10.41 POT50K.3
N$24
  Top 0.203: IC5.3 44.32,22.23 44.2,22.35 R14.1 43.37,23.43 43.18,23.62 41.4,23.62 40.89,24.13 R15.2
N$25  (via drill 0.38)
  Top 0.203: v46.23,12.74 43.78,12.74 42.72,13.8 42.72,14.56 42.16,15.12 42.16,20.57 41.47,21.27 R14.2
  Bottom 0.203: v46.23,12.74 49.02,9.94 49.02,6.86 49.28,6.6 POT1K.2
N$26
  Top 0.203: IC5.2 44.32,23.5 44.2,23.62 44.2,24.64 43.94,24.89 43.25,24.89 R9.2 43.18,25.65 43.43,25.9 44.19,25.9 44.45,26.16 44.45,26.42 44.7,26.67 R8.1
N$30
  Top 0.203: JP6.1 12.95,3.81 12.7,4.06 R24.2
N$31
  Top 0.203: JP6.3 20.07,3.81 20.32,4.06 R32.2
N$32  (via drill 0.38)
  Top 0.203: C36.2 4.76,11.36 5.08,11.68 Q3.1 6.86,14.22 v7.11,14.48 | U2.7 12.29,14.26 11.61,13.58 v10.41,13.58
  Bottom 0.203: v10.41,13.58 9.51,14.48 v7.11,14.48
N$33  (via drill 0.38)
  Top 0.203: C37.1 4.83,27.87 4.83,26.92 5.08,26.67 Q3.2 5.08,19.81 v6.86,18.03 | U2.8 12.21,13.46 v11.68,12.93
  Bottom 0.203: v6.86,18.03 10.67,14.22 10.68,14.22 11.68,13.22 v11.68,12.93
N$34
  Top 0.203: R41.2 43.43,11.18 42.93,11.68 41.15,11.68 40.57,12.26 R37.1
N$35
  Top 0.203: R29.2 40.89,9.65 41.14,9.4 41.91,9.4 42.16,9.14 42.16,8.89 42.61,8.45 R41.1
N$36
  Top 0.203: JP8.2 34.04,9.14 35.31,7.87 36.58,7.87 36.83,7.62 36.83,7.11 37.59,6.35 R40.2
N$37
  Top 0.203: JP8.3 35.56,10.67 35.88,10.35 R38.2
N$38
  Top 0.203: R37.2 36.58,13.21 36.07,12.7 35.14,12.7 34.12,11.68 JP8.4
ROTA
  Top 0.203: R32.1 C32.2 17.78,9.65 17.53,9.91 16.26,9.91 15.53,10.64 U2.10
ROTB
  Top 0.203: R24.1 C34.1 15.24,9.65 14.73,10.16 U2.9
ROTBTN
  Top 0.203: U2.11 16.33,10.5 16.51,10.31 22.96,10.31 23.18,10.09 R39.2 C31.2 23.18,5.52 23.88,4.83 23.88,4.06 23.62,3.81 JP7.2
SCK0
  Top 0.203: U2.17 22.86,13.46 23.11,13.21 23.11,11.68 25.79,11.68 26.98,10.5 26.98,8.46 28.13,7.31 29.61,7.31 30.57,6.35 U$2.SCK
SCK1  (via drill 0.38)
  Top 0.203: v30.89,36.21 31.76,36.21 32.67,35.3 IC1.7 | U2.24 v23.11,19.06 v23.11,19.05
  Bottom 0.203: v30.89,36.21 30.43,36.21 26.63,32.41 26.63,24.92 24.74,23.03 24.74,20.32 23.47,19.05 v23.11,19.05
SCL
  Top 0.203: U2.6 12.01,15.06 11.94,14.99 11.94,14.48 11.68,14.22 9.91,14.22 9.65,13.97 9.65,10.35 6.89,7.59 6.89,5.62 6.35,5.08 5.33,5.08 5.08,4.83 LCD/I2C1.1
SDA
  Top 0.203: U2.3 12.15,17.46 11.94,17.66 11.94,18.54 11.68,18.8 9.65,18.8 9.4,18.54 9.4,14.73 9.25,14.58 9.25,10.52 6.6,7.87 5.59,7.87 5.08,7.37 LCD/I2C1.2
SIG
  Top 0.203: IC1.10 33.6,33.78 32.77,33.78 32.26,33.27 32.26,32.51 31.82,32.07 C5.1 30.99,29.97 32.77,28.19 37.34,28.19 37.85,27.69 R6.1
SIG_OUT
  Top 0.203: IC5.6 49.66,22.23 49.28,22.61 49.28,25.91 48.51,26.67 R8.2 47.43,28.13 48.77,29.46 JP5.1
UC_RST  (via drill 0.38)
  Top 0.203: U2.29 17.13,21.44 17.27,21.59 R44.1 | R44.1 C40.1 | v19.56,23.3 19.3,23.05 19.3,22.81 19.17,22.67 R44.1
  Bottom 0.203: U$2.RST 29.21,8.23 22.06,15.38 22.06,23.41 21.84,23.62 19.88,23.62 v19.56,23.3

### Text on the board
tPlace: 1
bPlace: Christopher Gravelle | github.com/cwg19/Function-Generator | ECE 388 Fall 2020
_tplace: 4 | 3 | 2 | 1 | 1 | 2 | 3